# Altium schematic sheet Main.SchDoc
size 177 x 121 mm
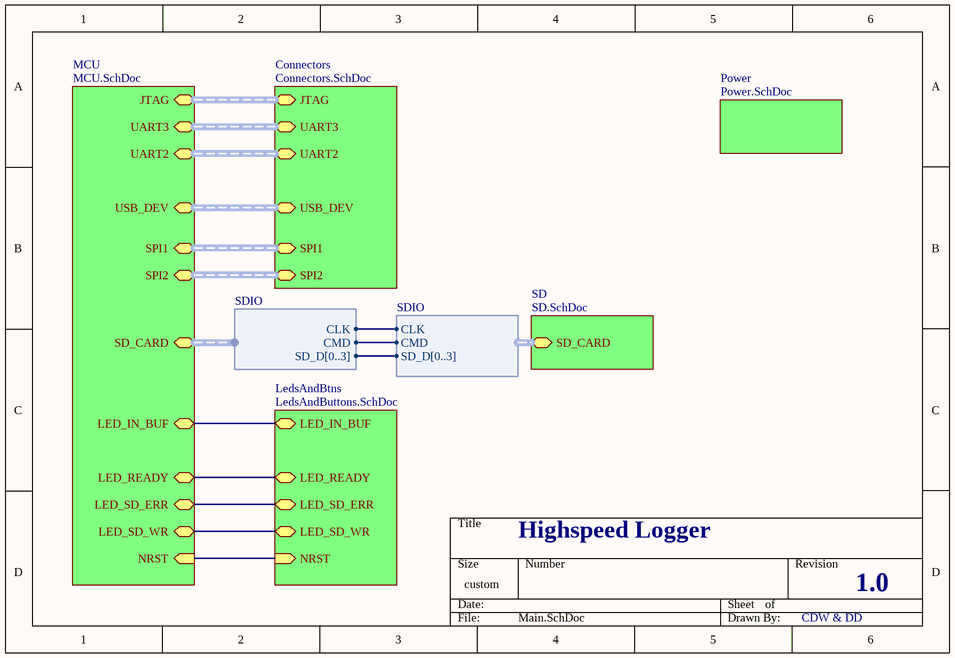
[diagram p0: Main.SchDoc]

## Sub-sheets
Connectors = Connectors.SchDoc: UART2 (harness UART), SPI1 (harness SPI), UART3 (harness UART), USB_DEV (harness USB), SPI2 (harness SPI), JTAG (harness JTAG)
LedsAndBtns = LedsAndButtons.SchDoc: LED_IN_BUF, LED_READY, LED_SD_ERR, LED_SD_WR, NRST (in)
MCU = MCU.SchDoc: UART2 (harness UART), SPI1 (harness SPI), UART3 (harness UART), USB_DEV (harness USB), SD_CARD (harness SDIO), LED_IN_BUF, LED_READY, LED_SD_ERR, LED_SD_WR, NRST (in), SPI2 (harness SPI), JTAG (harness JTAG)
Power = Power.SchDoc: no entries
SD = SD.SchDoc: SD_CARD (harness SDIO)

## Harnesses
SDIO: CLK, CMD, SD_D[0..3]

## Nets
(unnamed): sheet MCU/LED_IN_BUF, sheet LedsAndBtns/LED_IN_BUF
(unnamed): sheet MCU/LED_READY, sheet LedsAndBtns/LED_READY
(unnamed): sheet MCU/LED_SD_ERR, sheet LedsAndBtns/LED_SD_ERR
(unnamed): sheet MCU/LED_SD_WR, sheet LedsAndBtns/LED_SD_WR
(unnamed): sheet MCU/NRST, sheet LedsAndBtns/NRST
(unnamed): sheet SD/SD_CARD.CLK, sheet MCU/SD_CARD.CLK
(unnamed): sheet SD/SD_CARD.CMD, sheet MCU/SD_CARD.CMD

## Buses and harness runs
harness sheet Connectors/JTAG = sheet MCU/JTAG
harness sheet Connectors/SPI1 = sheet MCU/SPI1
harness sheet Connectors/SPI2 = sheet MCU/SPI2
harness sheet Connectors/UART2 = sheet MCU/UART2
harness sheet Connectors/UART3 = sheet MCU/UART3
harness sheet Connectors/USB_DEV = sheet MCU/USB_DEV

## Notes on the sheet
- Highspeed Logger
- 1.0
- CDW & DD